# EAGLE design f_divider (EAGLE 7.2.0)
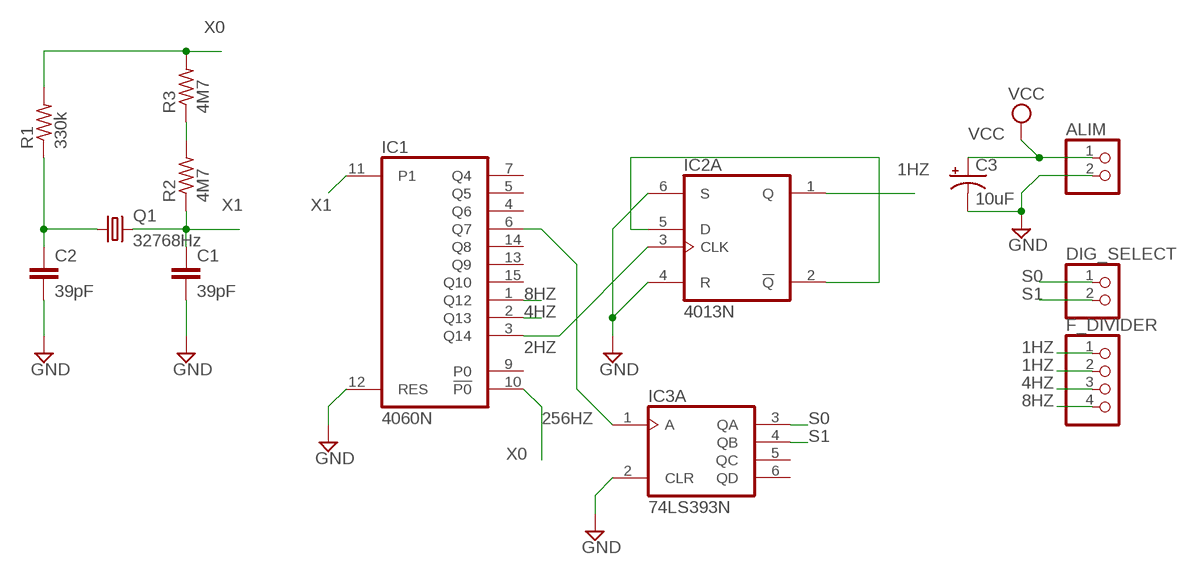
[diagram p0: schematic, sheet 1]

## Parts
ALIM  PINHD-1X2  [1X02]
C1  39pF  0.1UF-50V-20%(PTH)KIT-EZ  [CAP-PTH-SMALL-KIT]
C2  39pF  0.1UF-50V-20%(PTH)KIT-EZ  [CAP-PTH-SMALL-KIT]
C3  10uF  10UF-25V-20%(PTH)  [CPOL-RADIAL-10UF-25V]
DIG_SELECT  PINHD-1X2  [1X02]
F_DIVIDER  PINHD-1X4  [1X04]
IC1  4060N  [DIL16]
IC2  4013N  [DIL14]
IC3  74LS393N  [DIL14]
Q1  32768Hz  CRYSTALTC26H  [TC26H]
R1  330k  R-US_0204/7  [0204/7]
R2  4M7  R-US_0204/7  [0204/7]
R3  4M7  R-US_0204/7  [0204/7]

## Nets
1HZ: F_DIVIDER.1 F_DIVIDER.2 IC2.1(A:Q)
2HZ: IC1.3(Q14) IC2.3(A:CLK)
4HZ: F_DIVIDER.3 IC1.2(Q13)
8HZ: F_DIVIDER.4 IC1.1(Q12)
256HZ: IC1.6(Q7) IC3.1(A:A)
GND: ALIM.2 C1.2 C2.2 C3.2(-) IC1.12(RES) IC2.4(A:R) IC2.6(A:S) IC3.2(A:CLR)
N$2: C2.1 Q1.1 R1.1
N$4: R2.2 R3.1
N$8: IC2.2(A:!Q) IC2.5(A:D)
S0: DIG_SELECT.1 IC3.3(A:QA)
S1: DIG_SELECT.2 IC3.4(A:QB)
VCC: ALIM.1 C3.1(+)
X0: IC1.10(!P0) R1.2 R3.2
X1: C1.1 IC1.11(P1) Q1.2 R2.1
Unconnected: IC1.4(Q6) IC1.5(Q5) IC1.7(Q4) IC1.9(P0) IC1.13(Q9) IC1.14(Q8) IC1.15(Q10) IC2.8(B:S) IC2.9(B:D) IC2.10(B:R) IC2.11(B:CLK) IC2.12(B:!Q) IC2.13(B:Q) IC3.5(A:QC) IC3.6(A:QD) IC3.8(B:QD) IC3.9(B:QC) IC3.10(B:QB) IC3.11(B:QA) IC3.12(B:CLR) IC3.13(B:A)

## Power pins joined to a net without a drawn wire
GND: IC1.8(GND) IC2.7(P:GND) IC3.7(P:GND)
VCC: IC1.16(VCC) IC2.14(P:VCC) IC3.14(P:VCC)

## Library data of the parts
ALIM DIG_SELECT = pinhead:PINHD-1X2: PIN HEADER
C1 C2 = SparkFun-Capacitors:0.1UF-50V-20%(PTH): CAP-08370; PROD_ID: CAP-08370
C3 = SparkFun-Capacitors:10UF-25V-20%(PTH): CAP-08440; PROD_ID: CAP-08440
F_DIVIDER = pinhead:PINHD-1X4: PIN HEADER
IC1 = 40xx:4060: 14-stage binary/ripple COUNTER
IC2 = 40xx:4013: Dual D FLIP FLOP, set/reset
IC3 = 74xx-us:74*393: Dual 4-bit decade and binary COUNTER
Q1 = adafruit:CRYSTAL: CRYSTAL; OC_FARNELL: unknown; OC_NEWARK: unknown
R1-R3 = adafruit:R-US_: RESISTOR, American symbol

## Board
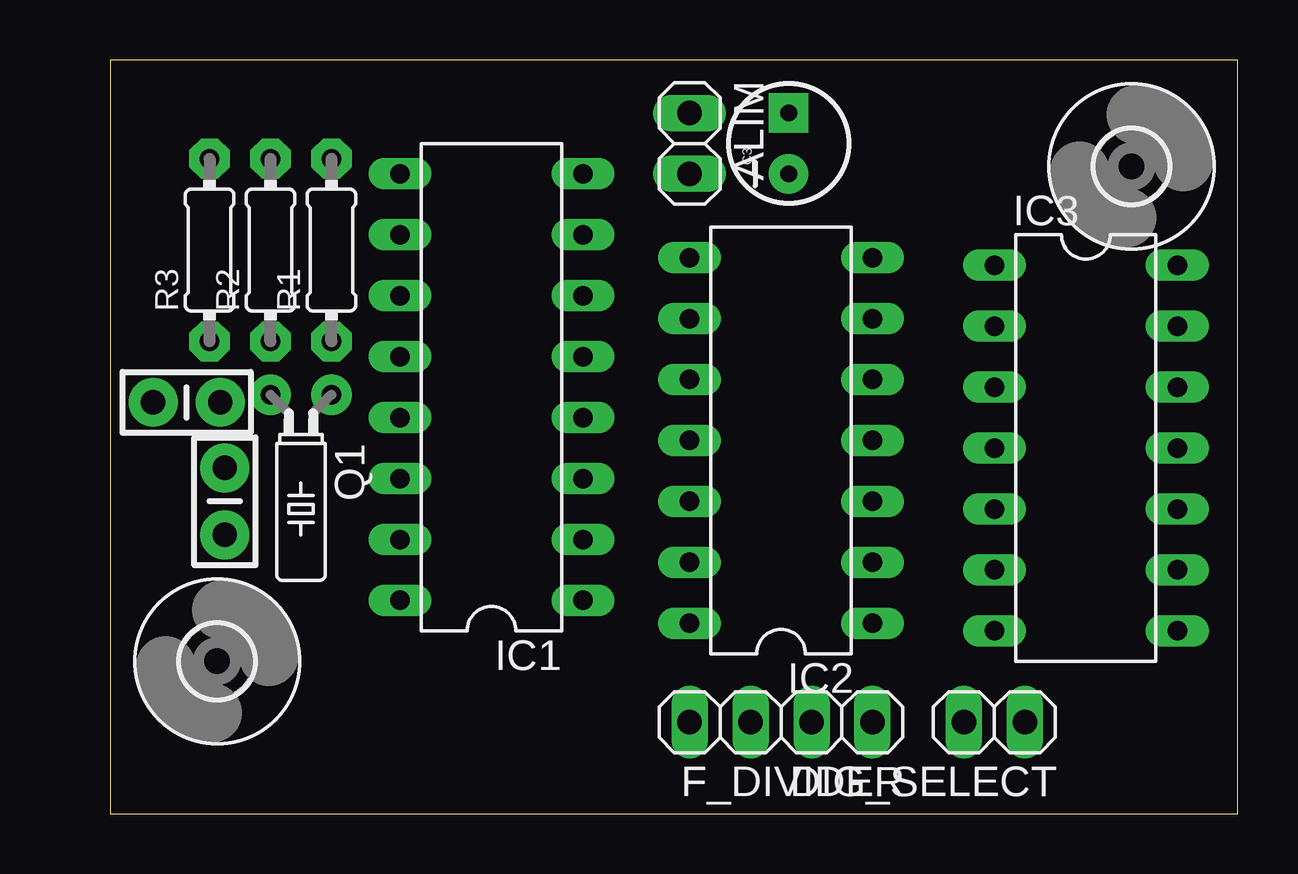
[diagram p1: board, top side]
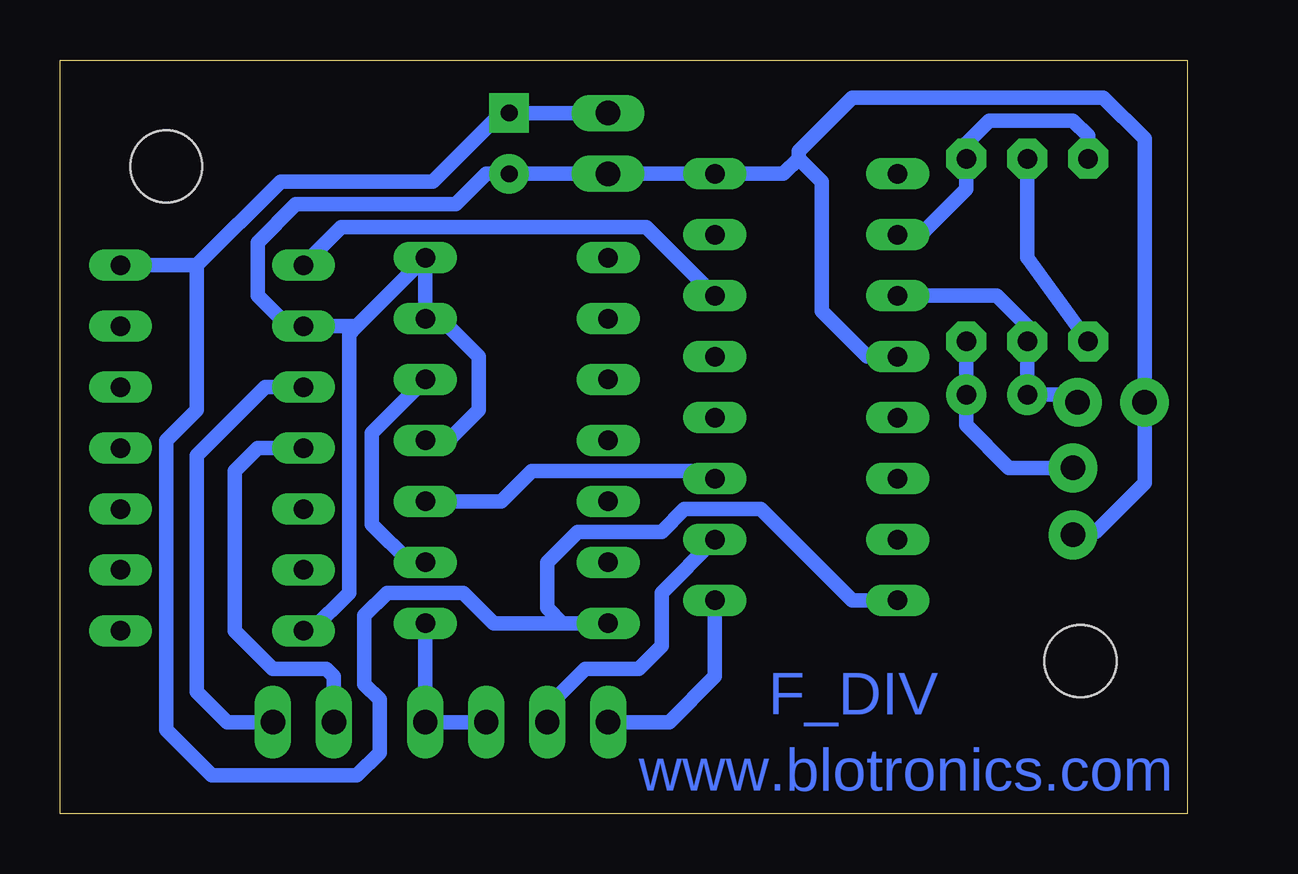
[diagram p2: board, bottom side, seen from below]

Size 46.97 x 31.42 mm. Coordinates in mm from the lower left corner, seen from the top.
Outline: 0,0 46.97,0 46.97,31.42 0,31.42 0,0
Copper layers (1*16): Top 0.035mm / dielectric 1.5mm / Bottom 0.035mm
Design rules "default": minimum track width 10mil, minimum drill 24mil, track to track 8mil, track to pad 8mil, pad to pad 8mil, via to via 8mil, smd to smd 8mil, copper to edge 40mil, drill to drill 8mil, minimum pad ring 10mil, minimum via ring 8mil, stop-mask expansion 4mil, vias tented up to drill 0mil, thermal gap 10mil

### Footprints (pad centres in the part's own frame; a part is rotated, then mirrored left to right if it is on the bottom)
1X02 = drill 1.016 long: 1 -1.27,0; 2 1.27,0
CAP-PTH-SMALL-KIT = drill 1.016 pad 2.032: 1 -1.397,0; 2 1.397,0
CPOL-RADIAL-10UF-25V = drill 0.7 pad 1.651 square: 1 1.27,0 | drill 0.7 pad 1.651: 2 -1.27,0
1X04 = drill 1.016 long: 1 -3.81,0; 2 -1.27,0; 3 1.27,0; 4 3.81,0
DIL16 = drill 0.813 long: 1 -8.89,-3.81; 2 -6.35,-3.81; 3 -3.81,-3.81; 4 -1.27,-3.81; 5 1.27,-3.81; 6 3.81,-3.81; 7 6.35,-3.81; 8 8.89,-3.81; 9 8.89,3.81; 10 6.35,3.81; 11 3.81,3.81; 12 1.27,3.81; 13 -1.27,3.81; 14 -3.81,3.81; 15 -6.35,3.81; 16 -8.89,3.81
DIL14 = drill 0.813 long: 1 -7.62,-3.81; 2 -5.08,-3.81; 3 -2.54,-3.81; 4 0,-3.81; 5 2.54,-3.81; 6 5.08,-3.81; 7 7.62,-3.81; 8 7.62,3.81; 9 5.08,3.81; 10 2.54,3.81; 11 0,3.81; 12 -2.54,3.81; 13 -5.08,3.81; 14 -7.62,3.81
TC26H = drill 0.813 pad 1.676: 1 -1.27,0; 2 1.27,0
0204/7 = drill 0.813 pad 1.676 octagon: 1 -3.81,0; 2 3.81,0
3,0 = hole 3: 0,0

### Placement (x,y rotation side)
ALIM  24.13,27.94 270 top
C1  3.18,17.14 180 top
C2  4.76,13.02 270 top
C3  28.26,27.94 90 top
DIG_SELECT  36.83,3.81 180 top
F_DIVIDER  27.94,3.81 180 top
IC1  15.87,17.78 90 top
IC2  27.94,15.56 90 top
IC3  40.64,15.24 270 top
Q1  7.94,17.46 180 top
R1  9.21,23.5 90 top
R2  6.67,23.5 90 top
R3  4.13,23.5 90 top
U$1  [3,0]  4.45,6.35 0 top
U$2  [3,0]  42.54,26.99 0 top

### Tracks (layer width: path | path; a pad name or v marks a point on that pad's centre or on a via)
1HZ
  Bottom 0.61: F_DIVIDER.2 F_DIVIDER.1 IC2.1
2HZ
  Bottom 0.61: IC2.3 28.57,13.02 27.3,14.29 20,14.29 IC1.3
4HZ
  Bottom 0.61: F_DIVIDER.3 26.67,4.45 25.08,6.03 22.86,6.03 21.91,6.99 21.91,9.21 IC1.2
8HZ
  Bottom 0.61: F_DIVIDER.4 21.59,3.81 19.69,5.71 IC1.1
256HZ
  Bottom 0.61: IC3.1 35.24,24.45 22.54,24.45 IC1.6
GND
  Bottom 0.61: 34.61,20.32 IC3.2 37.46,20.32 38.73,21.59 38.73,23.81 37.15,25.4 30.48,25.4 29.21,26.67 C3.2 ALIM.2 IC1.8 16.83,26.67 16.19,27.3 | 34.61,20.32 IC2.7 IC2.6 31.11,20.64 29.53,19.05 29.53,16.83 30.8,15.56 IC2.4 | IC3.7 36.51,7.62 34.92,9.21 34.92,20 34.61,20.32 | IC1.12 13.33,19.05 15.24,20.96 15.24,26.35 16.19,27.3 | 16.19,27.3 16.19,27.62 13.97,29.84 3.49,29.84 1.78,28.13 C1.2 1.78,13.78 3.81,11.75 4.63,11.75 C2.2
N$2
  Bottom 0.61: R1.1 9.21,18.1 Q1.1 9.21,16.19 7.43,14.41 C2.1
N$4
  Bottom 0.61: R2.2 6.67,23.18 R3.1
N$8
  Bottom 0.61: IC2.5 33.97,15.88 33.97,12.07 32.38,10.48 IC2.2
S0
  Bottom 0.61: DIG_SELECT.1 40,3.81 41.27,5.08 41.27,14.92 38.42,17.78 IC3.3
S1
  Bottom 0.61: IC3.4 38.73,15.24 39.69,14.29 39.69,7.62 38.1,6.03 35.88,6.03 35.56,5.71 DIG_SELECT.2
VCC
  Bottom 0.61: IC1.16 13.97,8.89 17.78,12.7 20.96,12.7 21.91,11.75 25.4,11.75 26.67,10.48 26.67,8.57 26.04,7.94 IC2.14 28.89,7.94 30.16,9.21 33.34,9.21 34.29,8.26 34.29,5.4 33.66,4.76 33.66,2.54 34.61,1.59 40.64,1.59 42.54,3.49 42.54,15.56 41.27,16.83 41.27,22.86 | ALIM.1 C3.1 28.57,29.21 31.43,26.35 37.78,26.35 41.27,22.86 | 41.27,22.86 IC3.14
X0
  Bottom 0.61: IC1.10 11.11,24.13 9.21,26.04 R1.2 9.21,27.94 8.25,28.89 4.76,28.89 4.13,28.26 R3.2
X1
  Bottom 0.61: C1.1 4.89,17.46 Q1.2 R2.1 6.67,20.32 7.94,21.59 IC1.11 12.7,21.59

### Text on the board
Bottom: F_DIV | www.blotronics.com